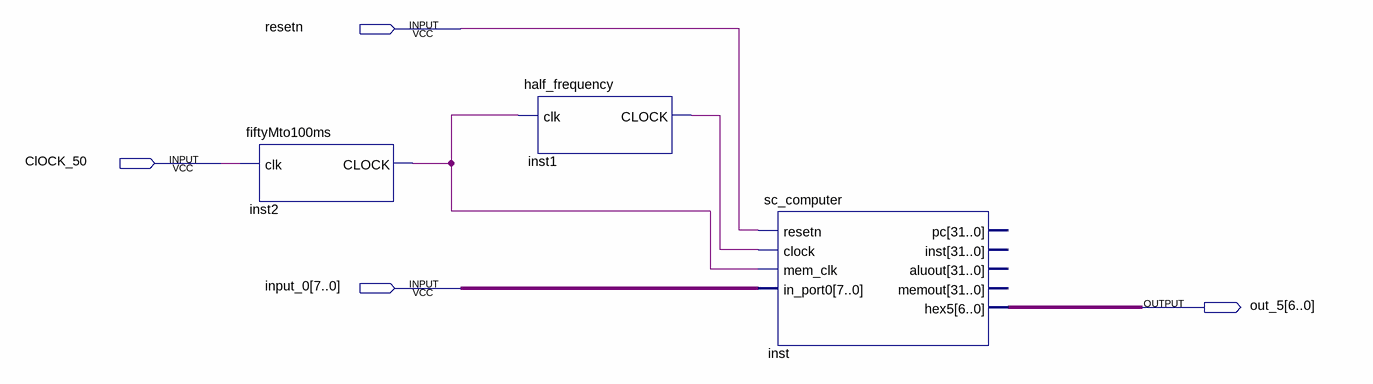
[diagram p0: schematic sheet]
// Quartus schematic sc_computer_test.bdf as structural Verilog: 3 symbols, 4 pins
module sc_computer_test (
  input  resetn,
  input  ClOCK_50,
  input  [7:0] input_0,
  output [6:0] out_5
);

  wire inst1_clock, inst2_clock;

  fiftyMto100ms inst2 (.clk(ClOCK_50), .CLOCK(inst2_clock));
  half_frequency inst1 (.clk(inst2_clock), .CLOCK(inst1_clock));
  sc_computer inst (
    .resetn(resetn), .clock(inst1_clock), .mem_clk(inst2_clock), .in_port0(input_0), .hex5(out_5));  // open: pc, inst, aluout, memout
endmodule
